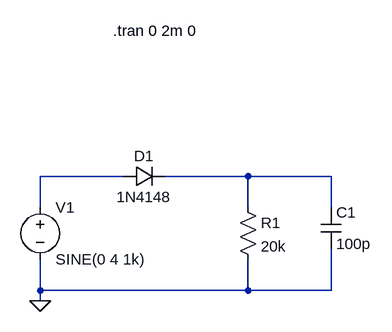
[diagram p0: schematic Einweggleichrichter.asc]
Einweggleichrichter.asc, the LTspice schematic file:
Version 4
SHEET 1 880 680
WIRE 80 80 -48 80
WIRE 272 80 144 80
WIRE 400 80 272 80
WIRE -48 128 -48 80
WIRE 272 128 272 80
WIRE 400 128 400 80
WIRE -48 256 -48 208
WIRE 272 256 272 208
WIRE 272 256 -48 256
WIRE 400 256 400 192
WIRE 400 256 272 256
WIRE -48 272 -48 256
FLAG -48 272 0
SYMBOL diode 80 96 R270
WINDOW 0 32 32 VTop 2
WINDOW 3 0 32 VBottom 2
SYMATTR InstName D1
SYMATTR Value 1N4148
SYMBOL res 256 112 R0
SYMATTR InstName R1
SYMATTR Value 20k
SYMBOL cap 384 128 R0
SYMATTR InstName C1
SYMATTR Value 100p
SYMBOL voltage -48 112 R0
WINDOW 123 0 0 Left 0
WINDOW 39 0 0 Left 0
SYMATTR InstName V1
SYMATTR Value SINE(0 4 1k)
TEXT 64 -144 Left 2 !.tran 0 2m 0

The netlist it stands for:
* Einweggleichrichter.asc
D1 N001 N002 1N4148
R1 N002 0 20k
C1 N002 0 100p
V1 N001 0 SINE(0 4 1k)
.model D D
.lib standard.dio
.tran 0 2m 0
.backanno
.end